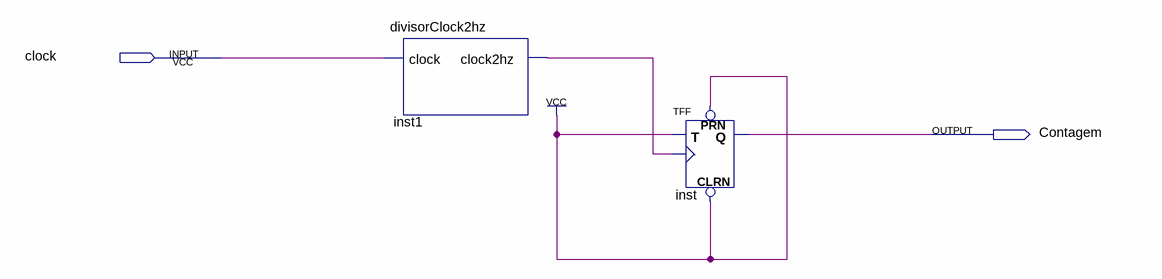
[diagram p0: schematic sheet]
// Quartus schematic contadorMod2.bdf as structural Verilog: 2 symbols, 2 pins
module contadorMod2 (
  input  clock,
  output Contagem
);

  wire inst1_clock2hz;

  divisorClock2hz inst1 (.clock(clock), .clock2hz(inst1_clock2hz));
  TFF inst (.PRN(1'b1), .CLRN(1'b1), .T(1'b1), .CLK(inst1_clock2hz), .Q(Contagem));
endmodule
